# Altium schematic sheet [0]Top.SchDoc
size A3; SheetNumber: 1; SheetTotal: 8
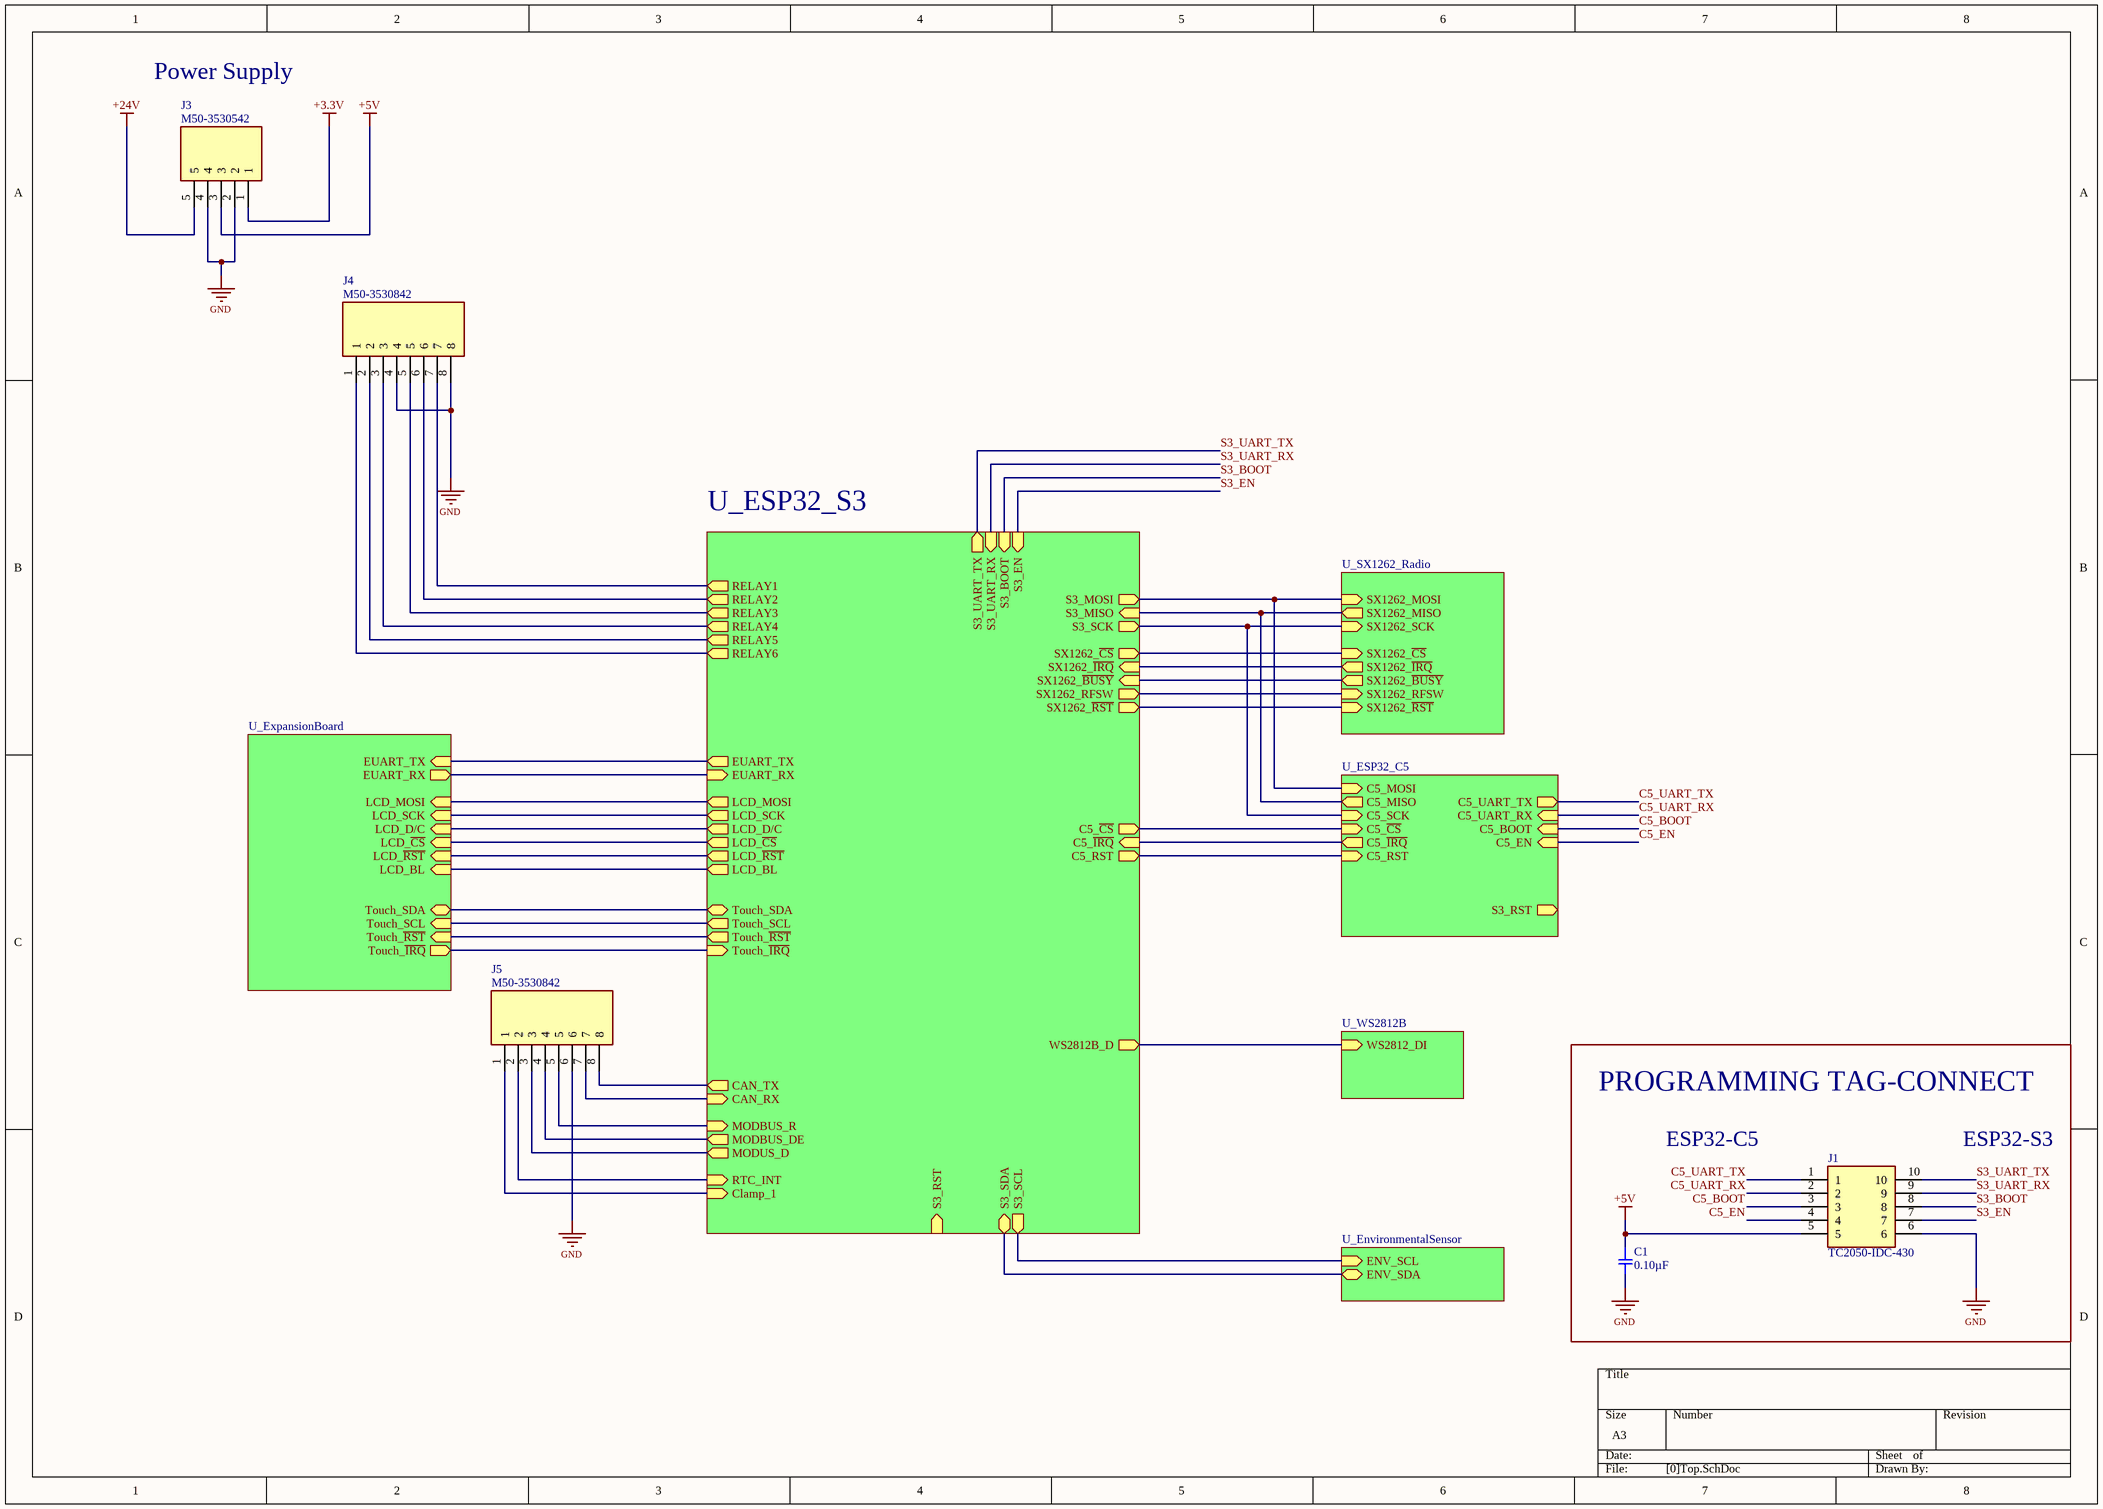
[diagram p0: [0]Top.SchDoc]

## Parts
C1  0.10µF  [SMD-0402C]
J1  TC2050-IDC-430  [TC2050-IDC]  (no BOM)
J3  M50-3530542  [HDRV5W40P0X127_1X5_635X210X400P]
J4  M50-3530842  [HDRV8W40P0X127_1X8_1016X210X400P]
J5  M50-3530842  [HDRV8W40P0X127_1X8_1016X210X400P]

## Blocks framed on the sheet
PROGRAMMING TAG-CONNECT: C1 J1

## Sub-sheets
U_EnvironmentalSensor = EnvironmentalSensor.SchDoc: ENV_SCL (in), ENV_SDA (bidir)
U_ESP32_C5 = ESP32_C5.SchDoc: C5_UART_TX (out), S3_RST (out), C5_MOSI (in), C5_MISO (out), C5_SCK (in), C5_~{CS} (in), C5_RST (in), C5_UART_RX (in), C5_BOOT (in), C5_EN (in), C5_~{IRQ} (out)
U_ESP32_S3 = ESP32_S3.SchDoc: Touch_SDA (bidir), Touch_SCL (out), S3_SDA (bidir), EUART_TX (out), EUART_RX (in), LCD_MOSI (out), Touch_~{IRQ} (in), LCD_SCK (out), RELAY1 (out), RELAY2 (out), RELAY3 (out), RELAY4 (out), RELAY5 (out), RELAY6 (out), LCD_~{CS} (out), LCD_D/C (out), LCD_~{RST} (out), Touch_~{RST} (out), LCD_BL (out), S3_MOSI (out), S3_MISO (in), S3_SCK (out), SX1262_~{CS} (out), SX1262_~{IRQ} (in), SX1262_RFSW (out), SX1262_~{RST} (out), S3_UART_TX (out), S3_UART_RX (in), S3_BOOT (in), S3_EN (in), S3_SCL (out), WS2812B_D (out), SX1262_~{BUSY} (in), S3_RST (in), C5_~{CS} (out), C5_~{IRQ} (in), C5_RST (out), CAN_TX (out), CAN_RX (in), MODUS_D (out), MODBUS_DE (out), MODBUS_R (in), RTC_INT (in), Clamp_1 (in)
U_ExpansionBoard = ExpansionBoard.SchDoc: LCD_MOSI (in), EUART_RX (out), EUART_TX (in), LCD_SCK (in), LCD_D/C (in), LCD_~{CS} (in), LCD_~{RST} (in), LCD_BL (in), Touch_~{IRQ} (out), Touch_~{RST} (in), Touch_SCL (in), Touch_SDA (bidir)
U_SX1262_Radio = SX1262_Radio.SchDoc: SX1262_SCK (in), SX1262_MOSI (in), SX1262_MISO (out), SX1262_~{CS} (in), SX1262_~{IRQ} (out), SX1262_RFSW (in), SX1262_~{RST} (in), SX1262_~{BUSY} (out)
U_WS2812B = WS2812B.SchDoc: WS2812_DI (in)

## Nets
+3.3V: J3.1
+5V: C1.1 J1.5 J3.3
+24V: J3.5
GND: C1.2 J1.6 J3.2 J3.4 J4.4 J4.8 J5.6
C5_BOOT: J1.3 ; sheet U_ESP32_C5/C5_BOOT
C5_EN: J1.4 ; sheet U_ESP32_C5/C5_EN
C5_UART_RX: J1.2 ; sheet U_ESP32_C5/C5_UART_RX
C5_UART_TX: J1.1 ; sheet U_ESP32_C5/C5_UART_TX
S3_BOOT: J1.8 ; sheet U_ESP32_S3/S3_BOOT
S3_EN: J1.7 ; sheet U_ESP32_S3/S3_EN
S3_UART_RX: J1.9 ; sheet U_ESP32_S3/S3_UART_RX
S3_UART_TX: J1.10 ; sheet U_ESP32_S3/S3_UART_TX
NetJ4_1: J4.1 ; sheet U_ESP32_S3/RELAY6
NetJ4_2: J4.2 ; sheet U_ESP32_S3/RELAY5
NetJ4_3: J4.3 ; sheet U_ESP32_S3/RELAY4
NetJ4_5: J4.5 ; sheet U_ESP32_S3/RELAY3
NetJ4_6: J4.6 ; sheet U_ESP32_S3/RELAY2
NetJ4_7: J4.7 ; sheet U_ESP32_S3/RELAY1
NetJ5_1: J5.1 ; sheet U_ESP32_S3/Clamp_1
NetJ5_2: J5.2 ; sheet U_ESP32_S3/RTC_INT
NetJ5_3: J5.3 ; sheet U_ESP32_S3/MODUS_D
NetJ5_4: J5.4 ; sheet U_ESP32_S3/MODBUS_DE
NetJ5_5: J5.5 ; sheet U_ESP32_S3/MODBUS_R
NetJ5_7: J5.7 ; sheet U_ESP32_S3/CAN_RX
NetJ5_8: J5.8 ; sheet U_ESP32_S3/CAN_TX
(unnamed): sheet U_ESP32_C5/C5_MOSI, sheet U_ESP32_S3/S3_MOSI, sheet U_SX1262_Radio/SX1262_MOSI
(unnamed): sheet U_ESP32_C5/C5_MISO, sheet U_ESP32_S3/S3_MISO, sheet U_SX1262_Radio/SX1262_MISO
(unnamed): sheet U_ESP32_C5/C5_SCK, sheet U_ESP32_S3/S3_SCK, sheet U_SX1262_Radio/SX1262_SCK
(unnamed): sheet U_ESP32_C5/C5_~{CS}, sheet U_ESP32_S3/C5_~{CS}
(unnamed): sheet U_ESP32_C5/C5_RST, sheet U_ESP32_S3/C5_RST
(unnamed): sheet U_ESP32_C5/C5_~{IRQ}, sheet U_ESP32_S3/C5_~{IRQ}
(unnamed): sheet U_ESP32_S3/Touch_SDA, sheet U_ExpansionBoard/Touch_SDA
(unnamed): sheet U_ESP32_S3/Touch_SCL, sheet U_ExpansionBoard/Touch_SCL
(unnamed): sheet U_ESP32_S3/S3_SDA, sheet U_EnvironmentalSensor/ENV_SDA
(unnamed): sheet U_ESP32_S3/EUART_TX, sheet U_ExpansionBoard/EUART_TX
(unnamed): sheet U_ESP32_S3/EUART_RX, sheet U_ExpansionBoard/EUART_RX
(unnamed): sheet U_ESP32_S3/LCD_MOSI, sheet U_ExpansionBoard/LCD_MOSI
(unnamed): sheet U_ESP32_S3/Touch_~{IRQ}, sheet U_ExpansionBoard/Touch_~{IRQ}
(unnamed): sheet U_ESP32_S3/LCD_SCK, sheet U_ExpansionBoard/LCD_SCK
(unnamed): sheet U_ESP32_S3/LCD_~{CS}, sheet U_ExpansionBoard/LCD_~{CS}
(unnamed): sheet U_ESP32_S3/LCD_D/C, sheet U_ExpansionBoard/LCD_D/C
(unnamed): sheet U_ESP32_S3/LCD_~{RST}, sheet U_ExpansionBoard/LCD_~{RST}
(unnamed): sheet U_ESP32_S3/Touch_~{RST}, sheet U_ExpansionBoard/Touch_~{RST}
(unnamed): sheet U_ESP32_S3/LCD_BL, sheet U_ExpansionBoard/LCD_BL
(unnamed): sheet U_ESP32_S3/SX1262_~{CS}, sheet U_SX1262_Radio/SX1262_~{CS}
(unnamed): sheet U_ESP32_S3/SX1262_~{IRQ}, sheet U_SX1262_Radio/SX1262_~{IRQ}
(unnamed): sheet U_ESP32_S3/SX1262_RFSW, sheet U_SX1262_Radio/SX1262_RFSW
(unnamed): sheet U_ESP32_S3/SX1262_~{RST}, sheet U_SX1262_Radio/SX1262_~{RST}
(unnamed): sheet U_ESP32_S3/S3_SCL, sheet U_EnvironmentalSensor/ENV_SCL
(unnamed): sheet U_ESP32_S3/WS2812B_D, sheet U_WS2812B/WS2812_DI
(unnamed): sheet U_ESP32_S3/SX1262_~{BUSY}, sheet U_SX1262_Radio/SX1262_~{BUSY}

## Notes on the sheet
- Power Supply
- ESP32-C5
- ESP32-S3

## Library data of the parts
C1 = GCM155R71C104KA55D: CAP CER 0.1UF 16V X7R 0402; Manufacturer: Murata Electronics North America; Factory Stock: 0; Unit Price (USD): 0.1; Minimum Quantity: 1; Tolerance: ±10%; Datasheets: http://www.murata.com/~/media/webrenewal/support/library/catalog/products/capacitor/mlcc/c03e.ashx; Image: //media.digikey.com/Renders/Murata%20Renders/ZRB-SERIES-0402.jpg; Digi-Key Part Number: 490-4759-1-ND; Part Number: GCM155R71C104KA55D; Quantity Available: 734194; @ qty: 0; Packaging: Cut Tape (CT); Series: GCM; Part Status: Active; Value: 0.10µF; Voltage: 16V; Temperature Coefficient: X7R; Operating Temperature: -55°C ~ 125°C; Features: -; Ratings: AEC-Q200; Applications: Automotive; Mounting Type: Surface Mount, MLCC; Package / Case: 0402 (1005 Metric); Size / Dimension: 0.039" L x 0.020" W (1.00mm x 0.50mm); Height - Seated (Max): -; Thickness (Max): 0.022" (0.55mm); Lead Spacing: -; Lead Style: -
J1 = TC2050-IDC-430: Connector; Manufacturer_Name: Tag Connect; Datasheet Link: https://datasheet.datasheetarchive.com/originals/distributors/Datasheets_SAMA/8a7b9a42a753a5cbaca4256ee093e59c.pdf; Manufacturer_Part_Number: TC2050-IDC-430
J3 = M50-3530542: Connector; Manufacturer_Name: Harwin; Datasheet Link: https://content.harwin.com/m/b82244d701975b38/original/DRG-02646-Technical-Drawing-Datasheet-M50-353-pdf.pdf; Height: 4mm; Manufacturer_Part_Number: M50-3530542; Mouser Part Number: 855-M50-3530542; Mouser Price/Stock: https://www.mouser.co.uk/ProductDetail/Harwin/M50-3530542?qs=%252BdQmOuGyFcHDSISYjHIhxg%3D%3D
J4 J5 = M50-3530842: Connector; Manufacturer_Name: Harwin; Datasheet Link: https://content.harwin.com/m/b82244d701975b38/original/DRG-02646-Technical-Drawing-Datasheet-M50-353-pdf.pdf; Height: 4mm; Manufacturer_Part_Number: M50-3530842; Mouser Part Number: 855-M50-3530842; Mouser Price/Stock: https://www.mouser.co.uk/ProductDetail/Harwin/M50-3530842?qs=%252BdQmOuGyFcHKRmyiVqsSSw%3D%3D